# EAGLE design Adafruit_TMP117_angle (EAGLE 9.6.2)
COMPANY: ADAFRUIT INDUSTRIES; DRAWN: KTOWN; REV: A
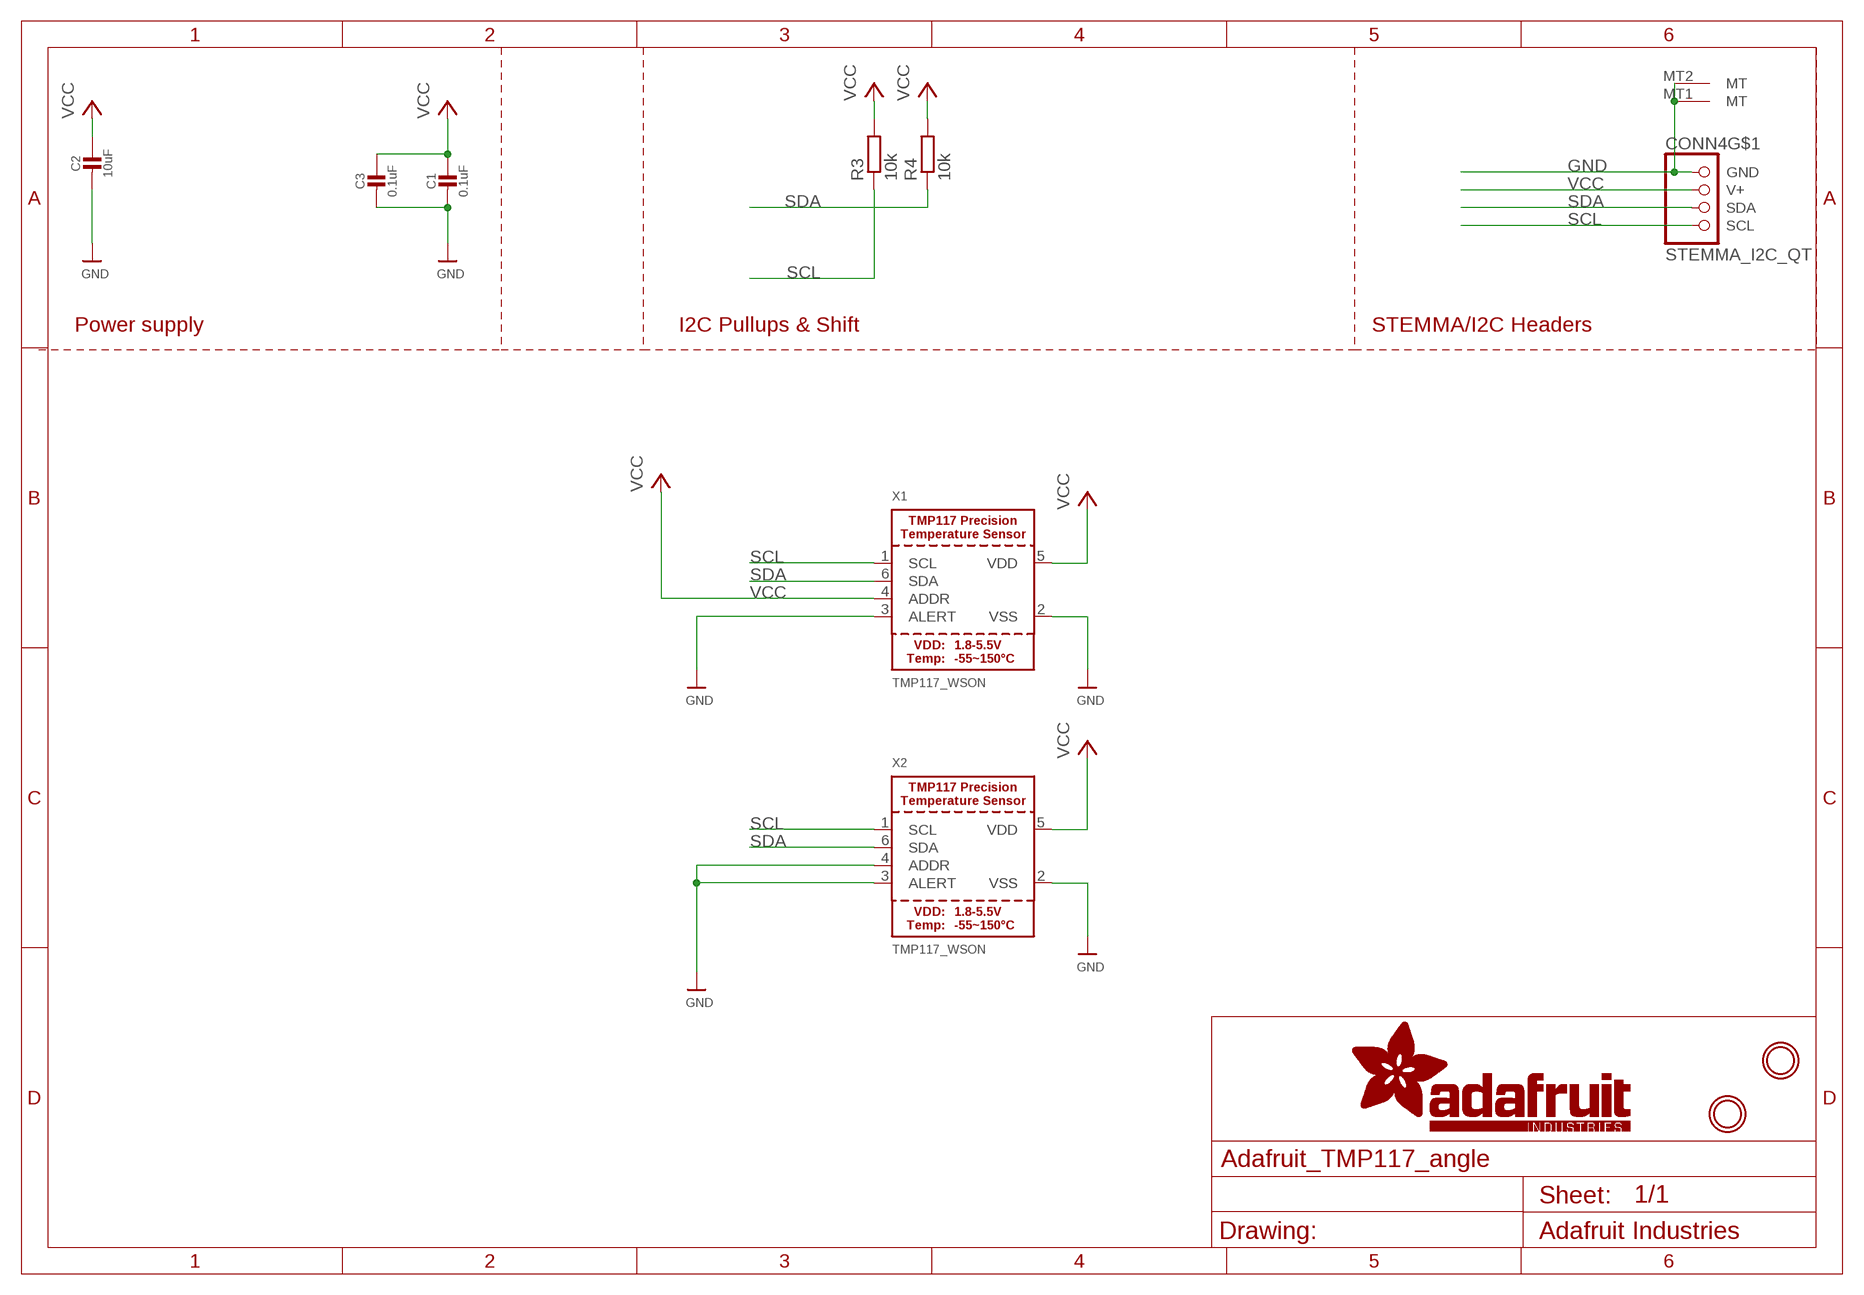
[diagram p0: schematic, sheet 1]

## Parts
C1  0.1uF  CAP_CERAMIC_0402  [_0402]
C2  10uF  CAP_CERAMIC_0603  [_0603]
C3  0.1uF  CAP_CERAMIC_0402  [_0402]
CONN4  STEMMA_I2C_QT  [JST_SH4]
R3  10k  R-EU_R0402  [R0402]
R4  10k  R-EU_R0402  [R0402]
U$1  MOUNTINGHOLE2.5  [MOUNTINGHOLE_2.5_PLATED]
U$19  MOUNTINGHOLE2.5  [MOUNTINGHOLE_2.5_PLATED]
X1  TMP117_WSON  [WSON-6]
X2  TMP117_WSON  [WSON-6]

## Nets
GND [highpower]: C1.2 C2.2 C3.2 CONN4.1(GND) CONN4.MT1(MT) CONN4.MT2(MT) X1.2(VSS) X1.3(ALERT) X2.2(VSS) X2.3(ALERT) X2.4(ADDR)
SCL: CONN4.4(SCL) R3.1 X1.1(SCL) X2.1(SCL)
SDA: CONN4.3(SDA) R4.1 X1.6(SDA) X2.6(SDA)
VCC [highpower]: C1.1 C2.1 C3.1 CONN4.2(V+) R3.2 R4.2 X1.4(ADDR) X1.5(VDD) X2.5(VDD)

## Notes on the sheet
- Power supply | I2C Pullups & Shift | STEMMA/I2C Headers

## Library data of the parts
C1-C3 = microbuilder:CAP_CERAMIC: Ceramic Capacitors For new designs, use the packages preceded by an '_' character since they are more reliable: The following footprints should be used on most boards: _0402 - Standard footprint for regular board layouts _0603 - Standard footprint for regular board layouts _0805 - Standard footprint for regular board layouts _1206 - Standard footprint for regular board layouts For extremely tight-pitch boards where space is at a premium, the following 'micro-pitch' footprints can be used (smaller pads, no silkscreen outline, etc.): _0402MP - Micro-pitch footprint for very dense/compact boards _0603MP - Micro-pitch footprint for very dense/compact boards _0805MP - Micro-pitch footprint for very dense/compact boards _1206MP - Micro-pitch footprint for very dense/compact boards
CONN4 = microbuilder:STEMMA_I2C
R3 R4 = rcl:R-EU_: RESISTOR, European symbol; SPICEPREFIX: R
U$1 U$19 = microbuilder:MOUNTINGHOLE: Mounting Hole For #2 screws (0.086"/2.18mm width, 0.094"/2.4mm hole) use 2.5mm; BOM: EXCLUDE
X1 X2 = adafruit_sensor:TMP117

## Net classes
1 highpower: width 0.305 mm, drill 0.483 mm
2 lowpower: width 0.254 mm, drill 0.483 mm

## Board
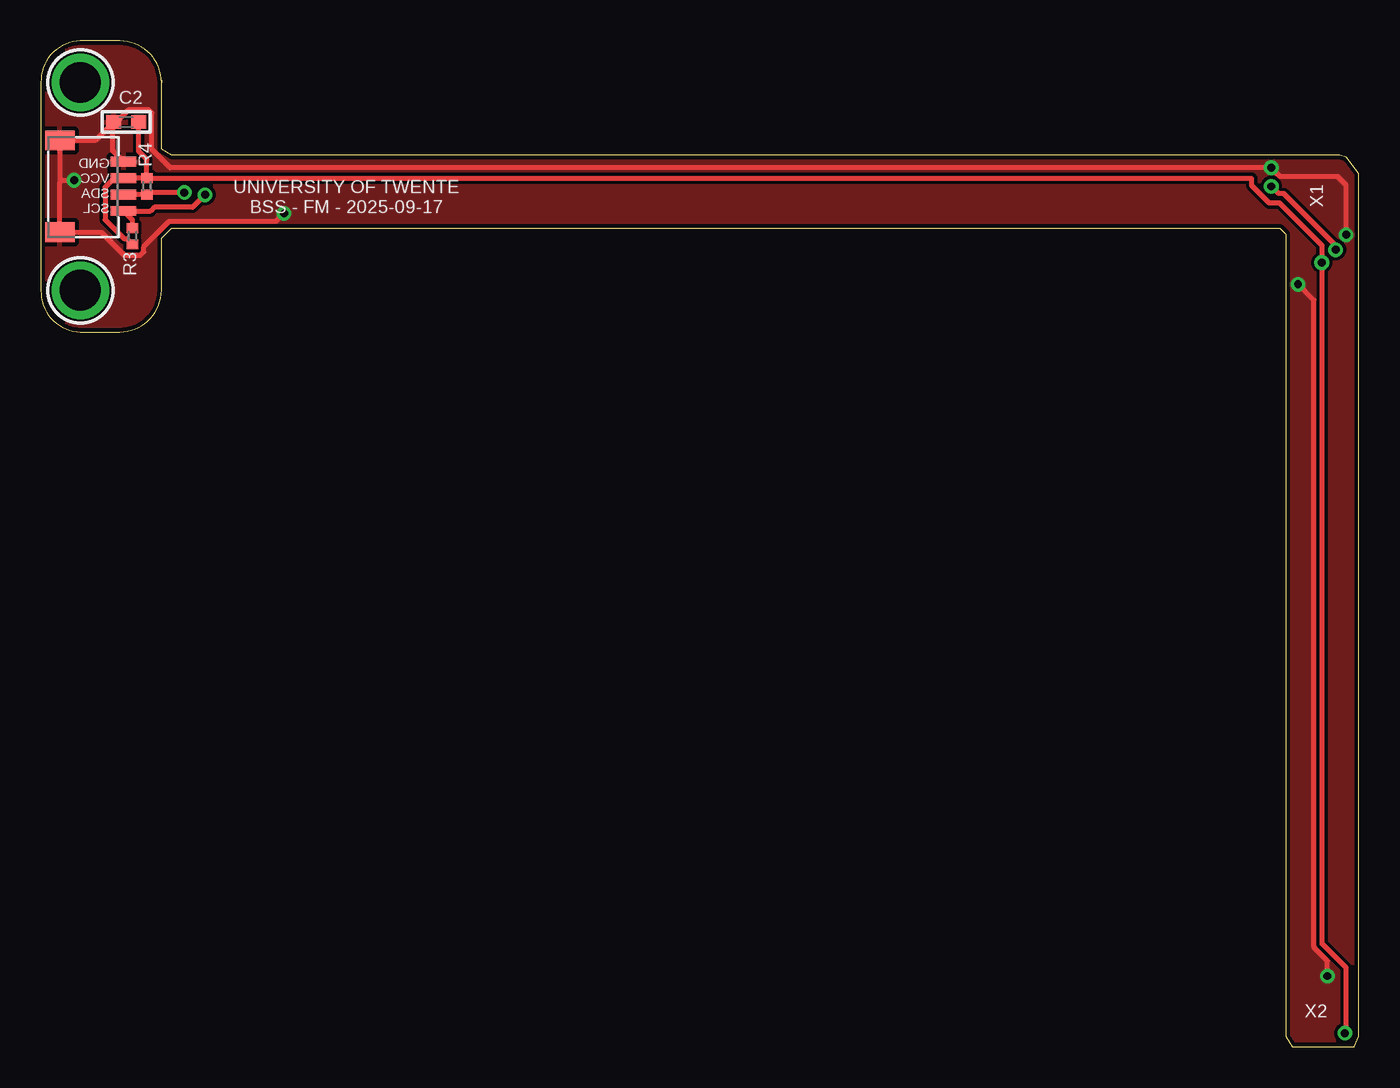
[diagram p1: board, top side]
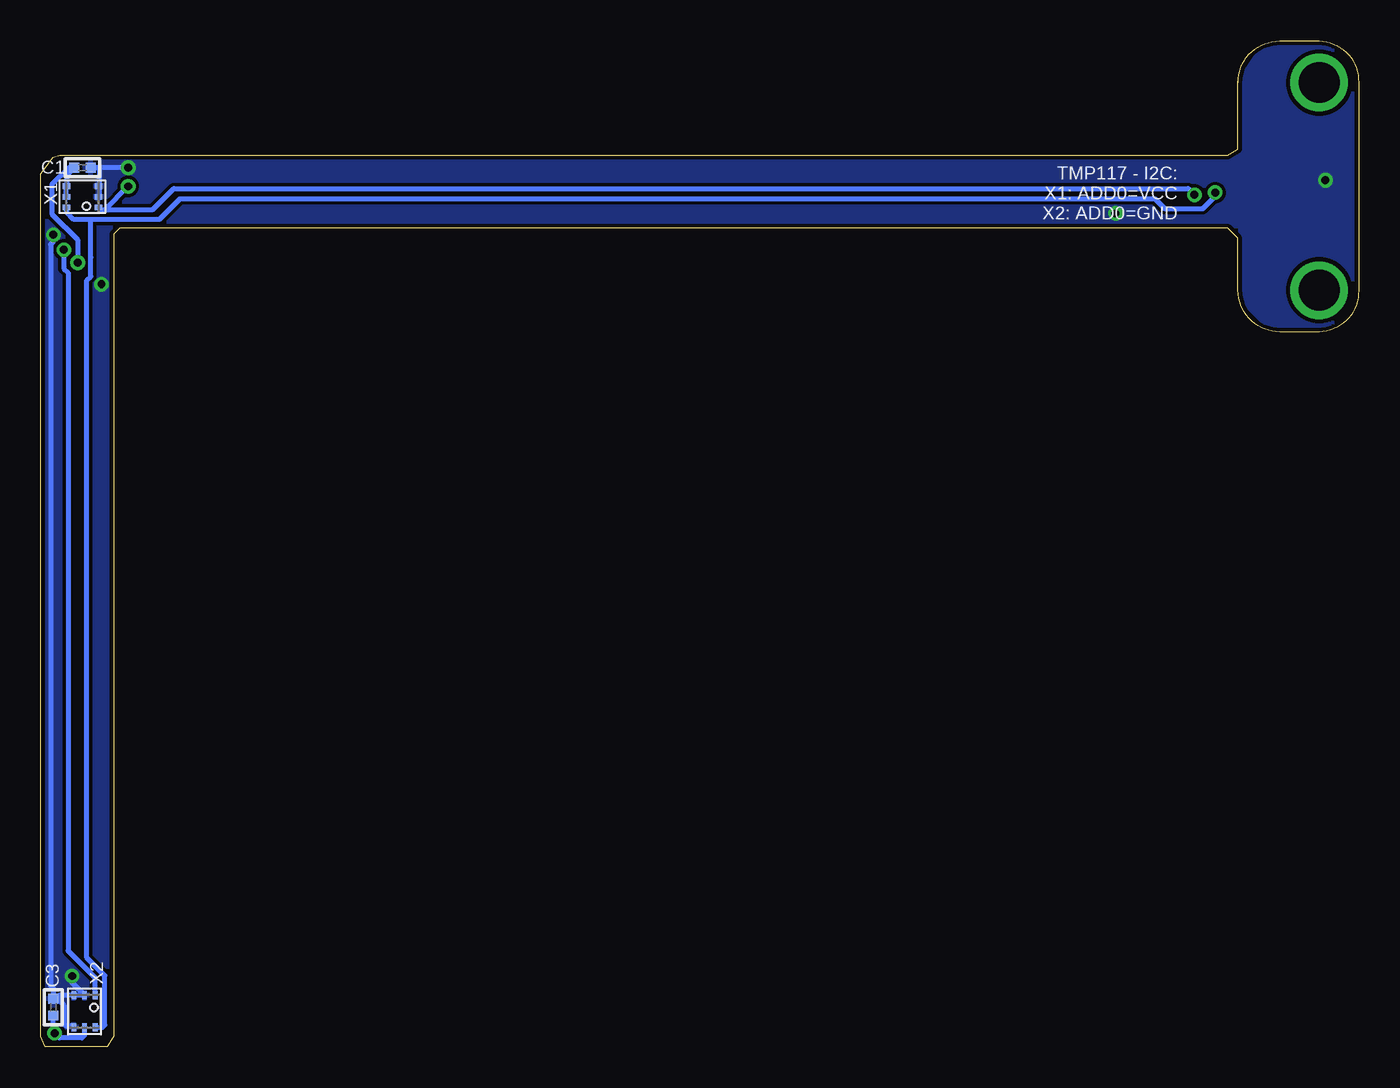
[diagram p2: board, bottom side, seen from below]

Size 80.52 x 61.47 mm. Coordinates in mm from the lower left corner, seen from the top.
Outline: 7.37,58.93 7.37,54.86 8,54.48 79.38,54.48 79.76,54.36 80.52,53.34 80.52,0.64 80.26,0 76.45,0 76.07,0.64 76.07,49.66 75.69,50.04 8,50.04 7.37,49.4 7.37,46.23 arc-90 4.83,43.69 2.41,43.69 arc-90 0,46.23 0,58.93 arc-90 2.41,61.47 4.83,61.47 arc-90 7.37,58.93
Outline: 7.37,59.06 7.37,58.93
Copper layers (1*16): Top 0.035mm / dielectric 1.5mm / Bottom 0.035mm
Design rules "adafruit *": minimum track width 8mil, minimum drill 15.5mil, track to track 8mil, track to pad 8mil, pad to pad 8mil, via to via 8mil, smd to smd 8mil, copper to edge 10mil, drill to drill 8mil, minimum pad ring 10mil, minimum via ring 8mil, stop-mask expansion 2mil, vias tented up to drill 20mil, thermal gap 10mil
bRestrict: area 77.3,50.9 to 78.6,53.2; area 76.8,1.5 to 78.9,2.8

### Footprints (pad centres in the part's own frame; a part is rotated, then mirrored left to right if it is on the bottom)
_0402 = smd 0.6 x 0.6: 1 -0.508,0; 2 0.508,0
_0603 = smd 0.9 x 0.8: 1 -0.762,0; 2 0.762,0
JST_SH4 = smd 0.6 x 1.55: 1 -1.5,2.514; 2 -0.5,2.514; 3 0.5,2.514; 4 1.5,2.514 | smd 1.2 x 1.8: MT1 -2.8,-1.386; MT2 2.8,-1.386
R0402 = smd 0.6 x 0.7: 1 -0.5,0; 2 0.5,0
MOUNTINGHOLE_2.5_PLATED = drill 2.5 pad 3.2: P$1 0,0
WSON-6 = smd 0.45 x 0.3: 1 -0.975,0.65; 2 -0.975,0; 3 -0.975,-0.65; 4 0.975,-0.65; 5 0.975,0; 6 0.975,0.65

### Placement (x,y rotation side)
C1  77.98,53.72 0 bottom
C2  5.21,56.52 180 top
C3  79.76,2.41 90 bottom
CONN4  2.54,52.58 270 top
R3  5.59,49.53 270 top
R4  6.48,52.58 90 top
U$1  2.41,58.93 0 top
U$19  2.41,46.23 0 top
X1  77.98,51.94 180 bottom
X2  77.85,2.16 270 bottom

### Tracks (layer width: path | path; a pad name or v marks a point on that pad's centre or on a via)
GND  (via drill 0.48)
  Top 0.305: 1.15,52.83 CONN4.MT1 3.31,55.38 4.38,56.45 | 1.15,52.83 CONN4.MT2 3.69,49.78 5.09,48.37 6.08,48.37 6.29,48.58 6.29,48.91 7.83,50.44 14.38,50.44 v14.86,50.93 | 1.15,52.83 1.28,52.96 v2.03,52.96 | 4.38,56.45 C2.2 4.62,56.52 5.37,57.27 6.57,57.27 6.78,57.06 6.78,54.84 7.89,53.72 v75.18,53.72 75.73,53.18 79.25,53.18 79.76,52.67 v79.76,49.62 | CONN4.1 4.38,54.75 4.38,56.45 | v78.61,4.32 78.61,5.25 77.79,6.08 77.79,45.63 v76.82,46.59
  Bottom 0.305: 76.96,52.59 76.96,53.72 C1.2 v75.18,53.72 | 76.96,52.59 X1.3 | 76.96,52.59 76.96,51.94 X1.2 | C3.2 79.76,2.79 79.42,3.13 X2.3 X2.2 78.61,3.9 v78.61,4.32 | C3.2 79.76,3.56 79.92,3.72 79.92,49.04 79.76,49.2 v79.76,49.62 | X2.4 78.59,1.27 78.99,1.27 79.1,1.38 79.1,2.52 79.5,2.92 C3.2
  pour Top: 0.13,45.72 2.03,43.82 3.68,43.82 5.46,43.82 7.24,45.59 7.24,45.85 7.24,59.82 7.11,59.94 5.71,61.34 5.46,61.34 1.78,61.34 0.76,60.33 0.13,58.8
  pour Bottom: 7.24,59.06 7.24,45.72 5.33,43.82 1.91,43.82 0.13,45.59 0.13,59.82 1.65,61.34 5.75,61.34
  pour Top: 7.24,54.36 7.24,50.17 76.2,50.17 76.2,0.51 76.58,0.13 80.14,0.13 80.39,0.76 80.39,53.34 79.38,54.36
  pour Bottom: 7.24,50.17 7.24,54.36 79.38,54.36 80.39,53.34 80.39,0.51 80.01,0.13 76.58,0.13 76.2,0.51 76.2,50.17
SCL  (via drill 0.48)
  Top 0.305: R3.1 5.59,50.54 CONN4.4 6.71,51.08 6.94,51.31 9.27,51.31 v10.03,52.07 | v79.12,48.7 79.12,48.96 75.95,52.13 75.63,52.13 v75.18,52.58
  Bottom 0.305: X1.1 76.88,51.17 76.6,51.17 | 76.6,51.17 73.68,51.17 72.39,52.45 10.41,52.45 v10.03,52.07 | 76.6,51.17 v75.18,52.58 | X2.1 77.2,4.22 78.85,5.87 78.85,47.29 79.12,47.56 v79.12,48.7
SDA  (via drill 0.48)
  Top 0.305: CONN4.3 R4.1 6.6,52.2 v8.76,52.2
  Bottom 0.305: X1.6 78.95,50.99 78.51,50.55 77.47,50.55 | v8.76,52.2 8.76,51.97 9.52,51.21 11.84,51.21 12.45,51.82 72.01,51.82 73.28,50.55 77.47,50.55 | X2.6 76.75,1.18 76.61,1.33 76.61,4.34 77.71,5.45 77.71,46.84 77.47,47.08 77.47,48.25 77.47,50.55
VCC  (via drill 0.48)
  Top 0.305: R4.2 5.28,53.08 5.17,52.97 CONN4.2 4.96,52.99 4.39,52.99 3.92,52.53 3.92,50.54 5.09,49.37 5.24,49.37 R3.2 | R4.2 6.48,54.23 5.98,54.73 5.97,54.73 5.97,54.74 C2.1 | v79.68,0.83 79.76,0.9 79.76,4.83 78.3,6.29 78.3,47.89 v78.27,47.92 78.27,48.98 75.69,51.56 75.06,51.56 73.99,52.63 73.99,53.08 R4.2
  Bottom 0.305: X2.5 77.87,1.17 77.87,0.69 78.02,0.53 79.38,0.53 79.76,0.91 C3.1 79.76,0.9 v79.68,0.83 | X1.5 78.99,51.94 78.99,52.59 X1.4 78.95,53.25 C1.1 78.83,53.72 79.84,52.7 79.84,50.89 78.27,49.31 v78.27,47.92

### Text on the board
tNames: X1 | GND / VCC / SDA / SCL | UNIVERSITY OF TWENTE / BSS - FM - 2025-09-17 | X2
bNames: TMP117 - I2C: / X1: ADD0=VCC / X2: ADD0=GND